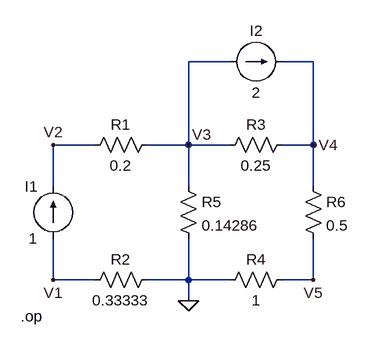
[diagram p0: schematic análise nodal - circuito aleatório 1.asc]
análise nodal - circuito aleatório 1.asc, the LTspice schematic file:
Version 4
SHEET 1 880 680
WIRE 352 -432 288 -432
WIRE 480 -432 432 -432
WIRE 144 -304 80 -304
WIRE 288 -304 288 -432
WIRE 288 -304 224 -304
WIRE 352 -304 288 -304
WIRE 480 -304 480 -432
WIRE 480 -304 432 -304
WIRE 80 -240 80 -304
WIRE 288 -240 288 -304
WIRE 480 -240 480 -304
WIRE 80 -96 80 -160
WIRE 144 -96 80 -96
WIRE 288 -96 288 -160
WIRE 288 -96 224 -96
WIRE 352 -96 288 -96
WIRE 480 -96 480 -160
WIRE 480 -96 432 -96
WIRE 288 -64 288 -96
FLAG 288 -64 0
FLAG 80 -96 V1
FLAG 80 -304 V2
FLAG 288 -304 V3
FLAG 480 -304 V4
FLAG 480 -96 V5
SYMBOL current 80 -160 R180
WINDOW 0 24 80 Left 2
WINDOW 3 24 0 Left 2
WINDOW 123 0 0 Left 0
WINDOW 39 0 0 Left 0
SYMATTR InstName I1
SYMATTR Value 1
SYMBOL current 352 -432 R270
WINDOW 0 32 40 VTop 2
WINDOW 3 -32 40 VBottom 2
WINDOW 123 0 0 Left 0
WINDOW 39 0 0 Left 0
SYMATTR InstName I2
SYMATTR Value 2
SYMBOL res 240 -320 R90
WINDOW 0 0 56 VBottom 2
WINDOW 3 32 56 VTop 2
SYMATTR InstName R1
SYMATTR Value 0.2
SYMBOL res 240 -112 R90
WINDOW 0 0 56 VBottom 2
WINDOW 3 32 56 VTop 2
SYMATTR InstName R2
SYMATTR Value 0.33333
SYMBOL res 448 -320 R90
WINDOW 0 0 56 VBottom 2
WINDOW 3 32 56 VTop 2
SYMATTR InstName R3
SYMATTR Value 0.25
SYMBOL res 448 -112 R90
WINDOW 0 0 56 VBottom 2
WINDOW 3 32 56 VTop 2
SYMATTR InstName R4
SYMATTR Value 1
SYMBOL res 272 -256 R0
SYMATTR InstName R5
SYMATTR Value 0.14286
SYMBOL res 464 -256 R0
SYMATTR InstName R6
SYMATTR Value 0.5
TEXT 30 -40 Left 2 !.op

The netlist it stands for:
* análise nodal - circuito aleatório 1.asc
I1 V1 V2 1
I2 V3 V4 2
R1 V3 V2 0.2
R2 0 V1 0.33333
R3 V4 V3 0.25
R4 V5 0 1
R5 V3 0 0.14286
R6 V4 V5 0.5
.op
.backanno
.end